# EAGLE design GPS Board Rev A (EAGLE 8.4.1)
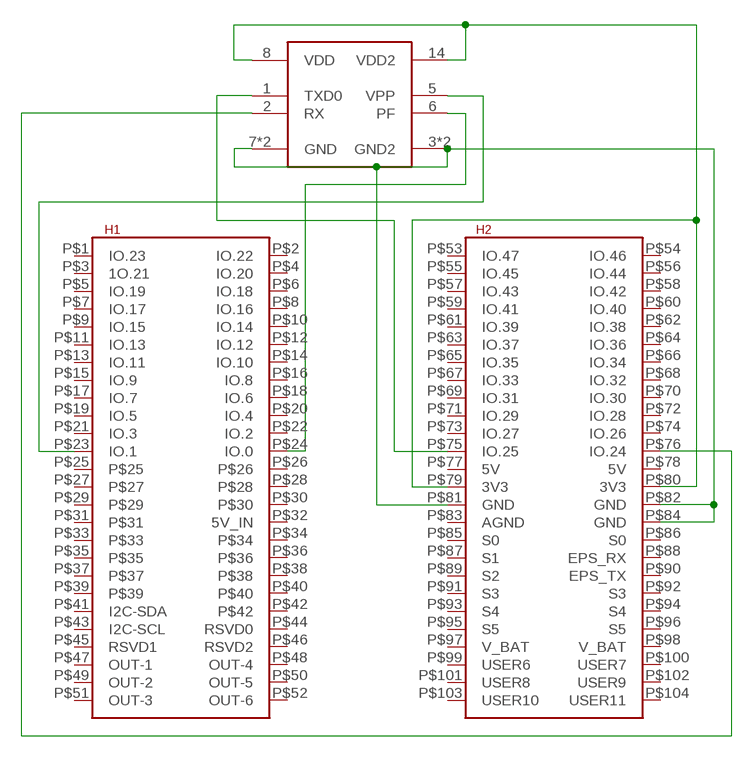
[diagram p0: schematic, sheet 1]

## Parts
U$1  PINAVL1  [PINAV-L1]
U$2  PC104  [PC104]

## Nets
GND: U$1.3(GND2) U$1.7(GND) U$1.15(GND2) U$1.16(GND) U$2.P$81(GND) U$2.P$82(GND) U$2.P$84(GND)
N$1: U$1.5(VPP) U$2.P$23(IO.1)
N$2: U$1.6(PF) U$2.P$24(IO.0)
N$3: U$1.8(VDD) U$1.14(VDD2) U$2.P$79(3V3) U$2.P$80(3V3)
N$4: U$1.1(TXD0) U$2.P$75(IO.25)
N$5: U$1.2(RX) U$2.P$76(IO.24)
Unconnected: U$2.P$1(IO.23) U$2.P$2(IO.22) U$2.P$3(1O.21) U$2.P$4(IO.20) U$2.P$5(IO.19) U$2.P$6(IO.18) U$2.P$7(IO.17) U$2.P$8(IO.16) U$2.P$9(IO.15) U$2.P$10(IO.14) U$2.P$11(IO.13) U$2.P$12(IO.12) U$2.P$13(IO.11) U$2.P$14(IO.10) U$2.P$15(IO.9) U$2.P$16(IO.8) U$2.P$17(IO.7) U$2.P$18(IO.6) U$2.P$19(IO.5) U$2.P$20(IO.4) U$2.P$21(IO.3) U$2.P$22(IO.2) U$2.P$25 U$2.P$26 U$2.P$27 U$2.P$28 U$2.P$29 U$2.P$30 U$2.P$31 U$2.P$32(5V_IN) U$2.P$33 U$2.P$34 U$2.P$35 U$2.P$36 U$2.P$37 U$2.P$38 U$2.P$39 U$2.P$40 U$2.P$41(I2C-SDA) U$2.P$42 U$2.P$43(I2C-SCL) U$2.P$44(RSVD0) U$2.P$45(RSVD1) U$2.P$46(RSVD2) U$2.P$47(OUT-1) U$2.P$48(OUT-4) U$2.P$49(OUT-2) U$2.P$50(OUT-5) U$2.P$51(OUT-3) U$2.P$52(OUT-6) U$2.P$53(IO.47) U$2.P$54(IO.46) U$2.P$55(IO.45) U$2.P$56(IO.44) U$2.P$57(IO.43) U$2.P$58(IO.42) U$2.P$59(IO.41) U$2.P$60(IO.40) U$2.P$61(IO.39) U$2.P$62(IO.38) U$2.P$63(IO.37) U$2.P$64(IO.36) U$2.P$65(IO.35) U$2.P$66(IO.34) U$2.P$67(IO.33) U$2.P$68(IO.32) U$2.P$69(IO.31) U$2.P$70(IO.30) U$2.P$71(IO.29) U$2.P$72(IO.28) U$2.P$73(IO.27) U$2.P$74(IO.26) U$2.P$77(5V) U$2.P$78(5V) U$2.P$83(AGND) U$2.P$85(S0) U$2.P$86(S0) U$2.P$87(S1) U$2.P$88(EPS_RX) U$2.P$89(S2) U$2.P$90(EPS_TX) U$2.P$91(S3) U$2.P$92(S3) U$2.P$93(S4) U$2.P$94(S4) U$2.P$95(S5) U$2.P$96(S5) U$2.P$97(V_BAT) U$2.P$98(V_BAT) U$2.P$99(USER6) U$2.P$100(USER7) U$2.P$101(USER8) U$2.P$102(USER9) U$2.P$103(USER10) U$2.P$104(USER11)

## Library data of the parts
U$1 = pinavl1:PINAVL1
U$2 = Cubesat:PC104

## Board
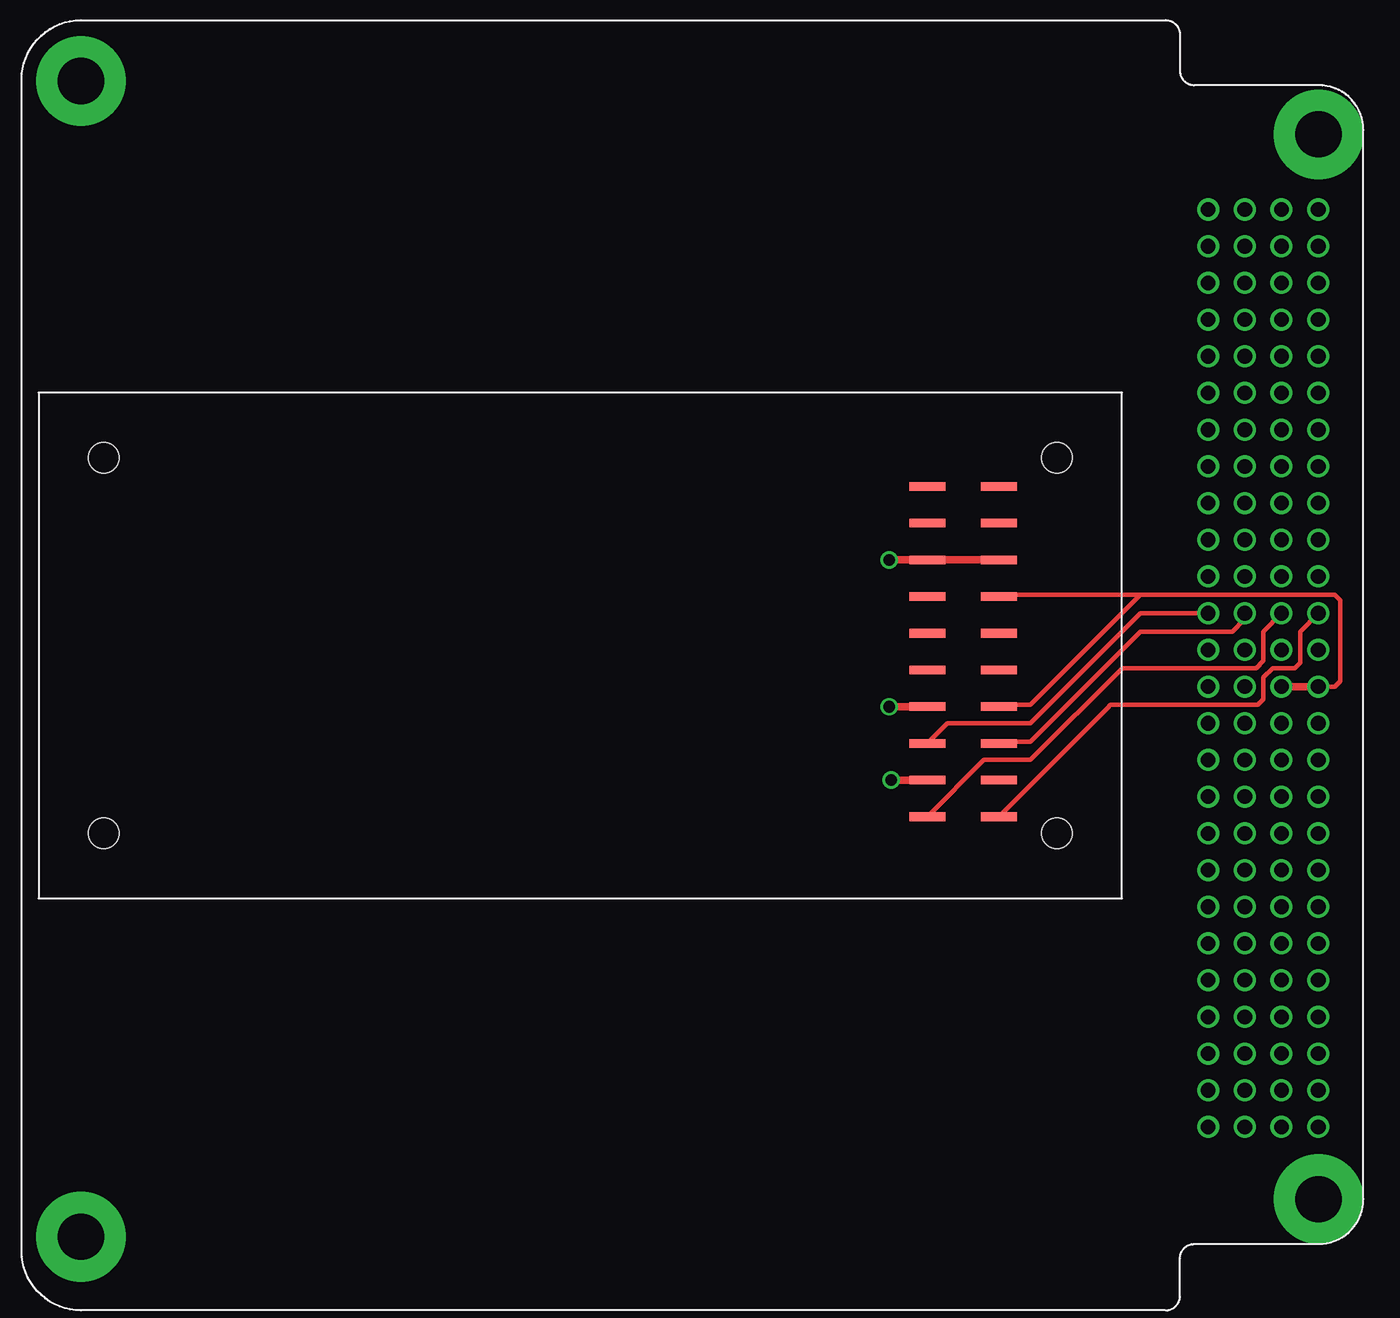
[diagram p1: board, top side]
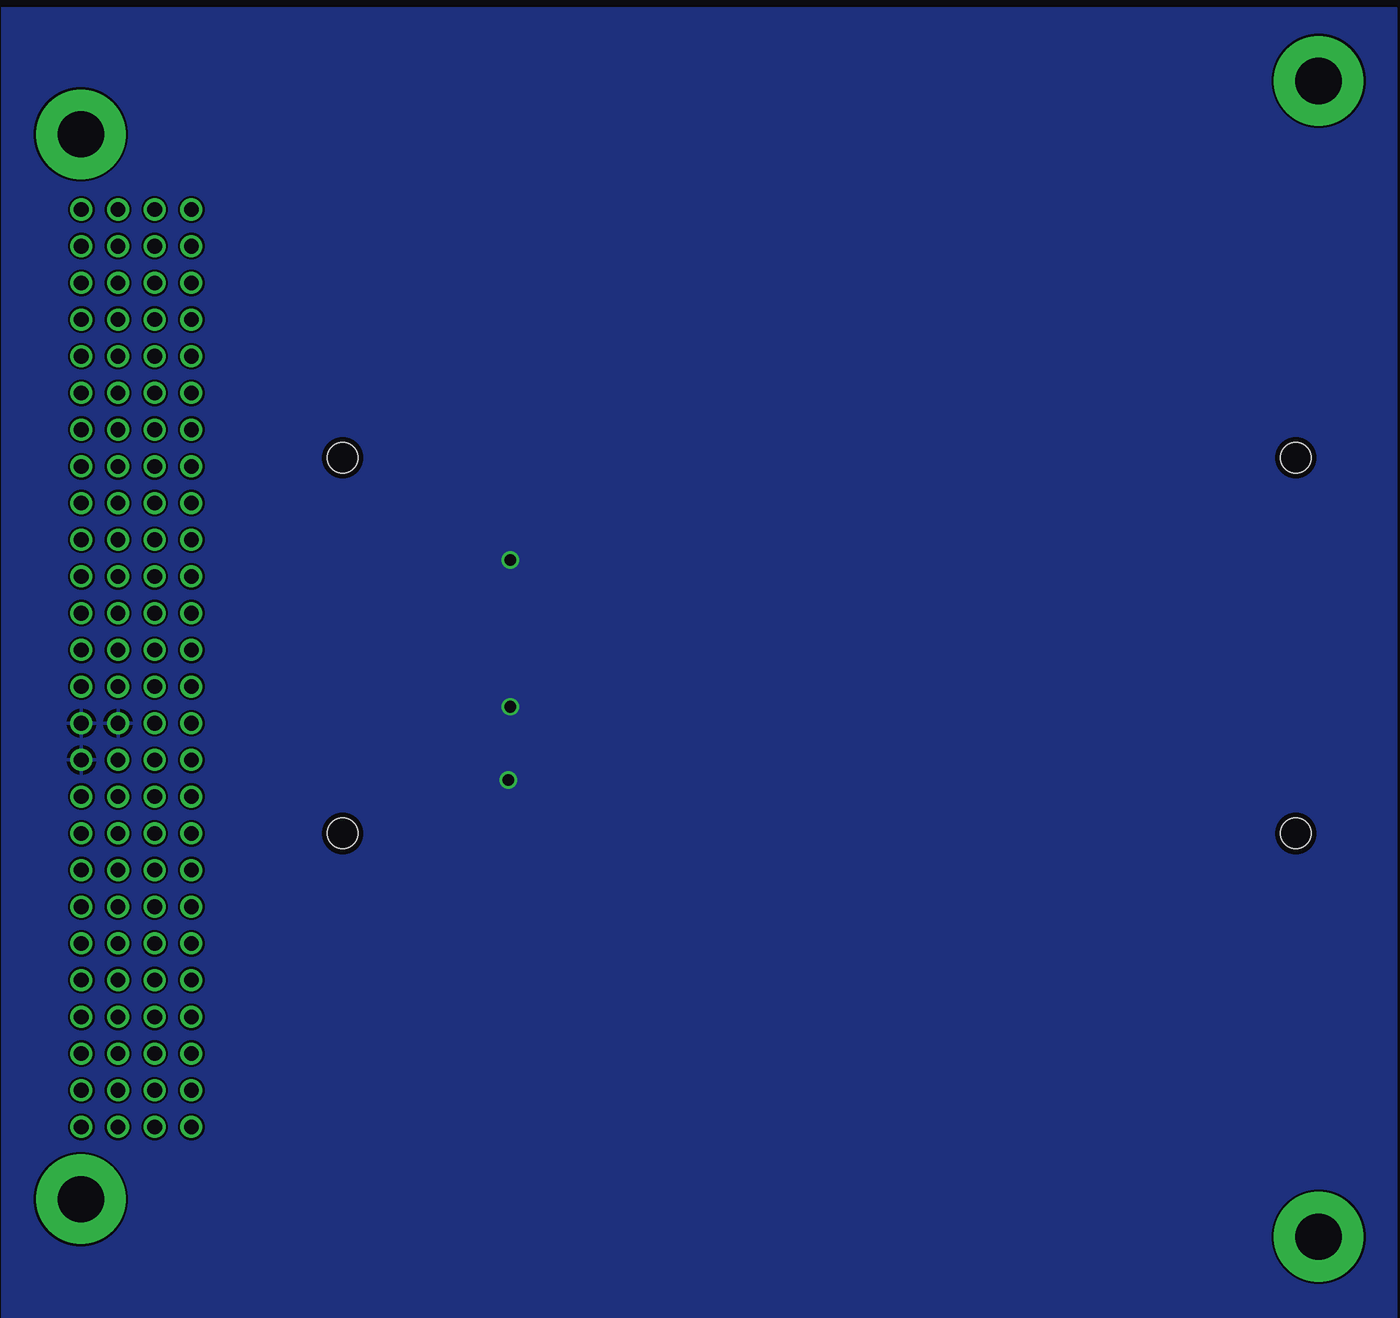
[diagram p2: board, bottom side, seen from below]

No outline drawn. Coordinates in mm, seen from the top.
Copper layers (1*16): Top 0.0356mm / dielectric 1.5011mm / Bottom 0.0356mm
Design rules "oshpark-2layer": minimum track width 6mil, minimum drill 13mil, track to track 6mil, track to pad 6mil, pad to pad 6mil, via to via 6mil, smd to smd 6mil, copper to edge 15mil, drill to drill 6mil, minimum pad ring 7mil, minimum via ring 7mil, stop-mask expansion 2.5mil, vias tented up to drill 0mil, thermal gap 10mil

### Footprints (pad centres in the part's own frame; a part is rotated, then mirrored left to right if it is on the bottom)
PINAV-L1 = smd 2.5 x 0.6: 1 24.61,-11.55; 2 29.55,-11.55; 3 24.61,-9.01; 4 29.55,-9.01; 5 24.61,-6.47; 6 29.55,-6.47; 7 24.61,-3.93; 8 29.55,-3.93; 9 24.61,-1.39; 10 29.55,-1.39; 11 24.61,1.15; 12 29.55,1.15; 13 24.61,3.69; 14 29.55,3.69; 15 24.61,6.23; 16 29.55,6.23; 17 24.61,8.77; 18 29.55,8.77; 19 24.61,11.31; 20 29.55,11.31 | hole 2.1: -32.42,-12.7; 33.58,-12.7; -32.42,13.3; 33.58,13.3
PC104 = drill 3.2 pad 6.2: MOUNT@1 4.1,85.1; MOUNT@2 4.1,5.1; MOUNT@3 89.8,81.4; MOUNT@4 89.8,7.7 | drill 1.016: P$1 82.151,76.2; P$2 84.691,76.2; P$3 82.151,73.66; P$4 84.691,73.66; P$5 82.151,71.12; P$6 84.691,71.12; P$7 82.151,68.58; P$8 84.691,68.58; P$9 82.151,66.04; P$10 84.691,66.04; P$11 82.151,63.5; P$12 84.691,63.5; P$13 82.151,60.96; P$14 84.691,60.96; P$15 82.151,58.42; P$16 84.691,58.42; P$17 82.151,55.88; P$18 84.691,55.88; P$19 82.151,53.34; P$20 84.691,53.34; P$21 82.151,50.8; P$22 84.691,50.8; P$23 82.151,48.26; P$24 84.691,48.26; P$25 82.151,45.72; P$26 84.691,45.72; P$27 82.151,43.18; P$28 84.691,43.18; P$29 82.151,40.64; P$30 84.691,40.64; P$31 82.151,38.1; P$32 84.691,38.1; P$33 82.151,35.56; P$34 84.691,35.56; P$35 82.151,33.02; P$36 84.691,33.02; P$37 82.151,30.48; P$38 84.691,30.48; P$39 82.151,27.94; P$40 84.691,27.94; P$41 82.151,25.4; P$42 84.691,25.4; P$43 82.151,22.86; P$44 84.691,22.86; P$45 82.151,20.32; P$46 84.691,20.32; P$47 82.151,17.78; P$48 84.691,17.78; P$49 82.151,15.24; P$50 84.691,15.24; P$51 82.151,12.7; P$52 84.691,12.7; P$53 87.231,76.2; P$54 89.771,76.2; P$55 87.231,73.66; P$56 89.771,73.66; P$57 87.231,71.12; P$58 89.771,71.12; P$59 87.231,68.58; P$60 89.771,68.58; P$61 87.231,66.04; P$62 89.771,66.04; P$63 87.231,63.5; P$64 89.771,63.5; P$65 87.231,60.96; P$66 89.771,60.96; P$67 87.231,58.42; P$68 89.771,58.42; P$69 87.231,55.88; P$70 89.771,55.88; P$71 87.231,53.34; P$72 89.771,53.34; P$73 87.231,50.8; P$74 89.771,50.8; P$75 87.231,48.26; P$76 89.771,48.26; P$77 87.231,45.72; P$78 89.771,45.72; P$79 87.231,43.18; P$80 89.771,43.18; P$81 87.231,40.64; P$82 89.771,40.64; P$83 87.231,38.1; P$84 89.771,38.1; P$85 87.231,35.56; P$86 89.771,35.56; P$87 87.231,33.02; P$88 89.771,33.02; P$89 87.231,30.48; P$90 89.771,30.48; P$91 87.231,27.94; P$92 89.771,27.94; P$93 87.231,25.4; P$94 89.771,25.4; P$95 87.231,22.86; P$96 89.771,22.86; P$97 87.231,20.32; P$98 89.771,20.32; P$99 87.231,17.78; P$100 89.771,17.78; P$101 87.231,15.24; P$102 89.771,15.24; P$103 87.231,12.7; P$104 89.771,12.7

### Placement (x,y rotation side)
U$1  38.1,46.99 0 top
U$2  0,1.27 0 top

### Tracks (layer width: path | path; a pad name or v marks a point on that pad's centre or on a via)
GND  (via drill 0.8)
  Top 0.508: v60.07,53.21 v60.08,53.22 U$1.15 U$1.16 | U$1.3 v60.2,37.98 v60.2,37.97 | U$1.7 v60.08,43.06 v60.07,43.05
  pour Bottom: -1.27,91.44 -1.27,0 95.25,0 95.25,91.44
N$1
  Top 0.305: U$1.5 64.1,41.91 69.85,41.91 77.47,49.53 U$2.P$23
N$2
  Top 0.305: U$1.6 67.77,40.64 69.85,40.64 77.47,48.26 83.82,48.26 84.69,49.13 U$2.P$24
N$3
  Top 0.305: U$1.8 67.77,43.18 69.85,43.18 77.47,50.8 | U$2.P$80 90.93,44.45 91.31,44.83 91.31,50.42 90.93,50.8 77.47,50.8 | U$1.14 67.77,50.8 77.47,50.8
  Top 0.508: U$2.P$80 U$2.P$79
N$4
  Top 0.305: U$1.1 66.64,39.37 69.85,39.37 76.2,45.72 85.47,45.72 85.98,46.23 85.98,48.26 87.23,49.51 U$2.P$75
N$5
  Top 0.305: U$1.2 75.16,42.95 75.39,43.18 85.6,43.18 85.98,43.56 85.98,44.45 | 85.98,44.45 85.98,44.07 | 85.98,44.45 85.98,45.09 86.61,45.72 88.14,45.72 88.52,46.1 88.52,48.26 89.77,49.51 U$2.P$76